# Altium schematic sheet Main.SchDoc: Raspberry Pi - Top Level Schematic
size 406 x 203 mm; DrawnBy: Kace Chandler; DocumentNumber: 1; SheetNumber: 1; SheetTotal: 23
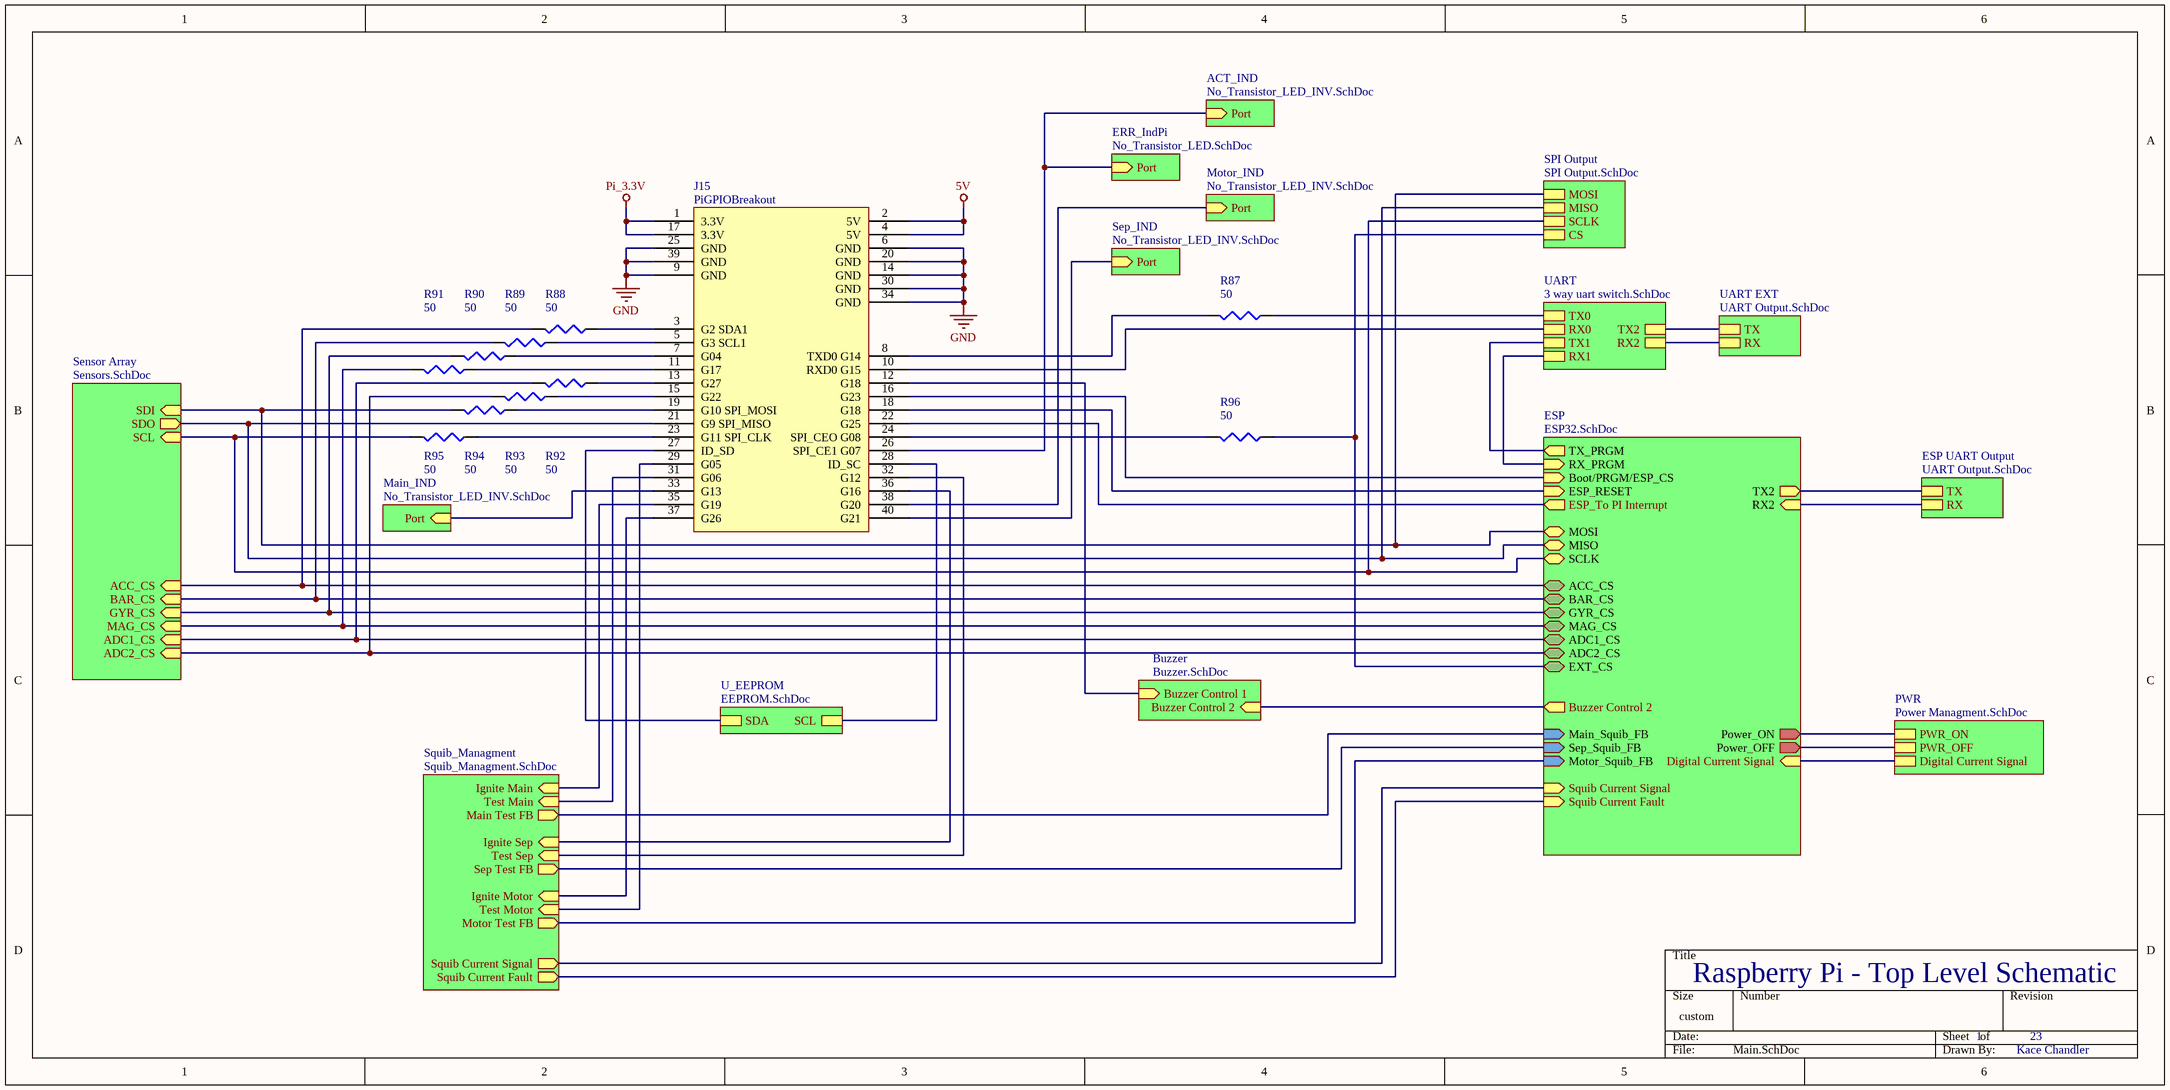
[diagram p0: Main.SchDoc]

## Parts
J15  PiGPIOBreakout  [RPI Through board connector]
R87  value 50  (hidden comment: Res3)
R88  value 50  (hidden comment: Res3)
R89  value 50  (hidden comment: Res3)
R90  value 50  (hidden comment: Res3)
R91  value 50  (hidden comment: Res3)
R92  value 50  (hidden comment: Res3)
R93  value 50  (hidden comment: Res3)
R94  value 50  (hidden comment: Res3)
R95  value 50  (hidden comment: Res3)
R96  value 50  (hidden comment: Res3)

## Sub-sheets
ACT_IND = No_Transistor_LED_INV.SchDoc: Port (in)
Buzzer = Buzzer.SchDoc: Buzzer Control 1 (in), Buzzer Control 2 (in)
ERR_IndPi = No_Transistor_LED.SchDoc: Port (in)
ESP = ESP32.SchDoc: TX_PRGM (out), RX_PRGM (in), Boot/PRGM/ESP_CS (in), RX2 (in), TX2 (out), SCLK (bidir), MISO (bidir), MOSI (bidir), Sep_Squib_FB (in), Main_Squib_FB (in), Motor_Squib_FB (in), Power_ON (out), Power_OFF (out), ACC_CS (bidir), BAR_CS (bidir), GYR_CS (bidir), MAG_CS (bidir), ADC1_CS (bidir), ADC2_CS (bidir), EXT_CS (bidir), ESP_RESET (in), Digital Current Signal (in), Squib Current Signal (in), Squib Current Fault (in), Buzzer Control 2 (out), ESP_To PI Interrupt (out)
ESP UART Output = UART Output.SchDoc: TX, RX
Main_IND = No_Transistor_LED_INV.SchDoc: Port (in)
Motor_IND = No_Transistor_LED_INV.SchDoc: Port (in)
PWR = Power Managment.SchDoc: PWR_ON, PWR_OFF, Digital Current Signal
Sensor Array = Sensors.SchDoc: ACC_CS (in), BAR_CS (in), GYR_CS (in), MAG_CS (in), ADC1_CS (in), ADC2_CS (in), SCL (in), SDO (out), SDI (in)
Sep_IND = No_Transistor_LED_INV.SchDoc: Port (in)
SPI Output = SPI Output.SchDoc: MOSI, MISO, SCLK, CS
Squib_Managment = Squib_Managment.SchDoc: Ignite Main (in), Test Main (in), Main Test FB (out), Ignite Sep (in), Test Sep (in), Sep Test FB (out), Ignite Motor (in), Test Motor (in), Motor Test FB (out), Squib Current Signal (out), Squib Current Fault (out)
U_EEPROM = EEPROM.SchDoc: SDA, SCL
UART = 3 way uart switch.SchDoc: TX1, RX1, TX2, RX2, TX0, RX0
UART EXT = UART Output.SchDoc: TX, RX

## Nets
5V: J15.2(5V) J15.4(5V)
GND: J15.6(GND) J15.9(GND) J15.14(GND) J15.20(GND) J15.25(GND) J15.30(GND) J15.34(GND) J15.39(GND)
Pi_3.3V: J15.1(3.3V) J15.17(3.3V)
NetJ15_3: J15.3(G2_SDA1) R88.1
NetJ15_5: J15.5(G3_SCL1) R89.1
NetJ15_7: J15.7(G04) R90.1
NetJ15_8: J15.8(TXD0_G14) R87.2
NetJ15_10: J15.10(RXD0_G15) ; sheet UART/RX0
NetJ15_11: J15.11(G17) R91.1
NetJ15_12: J15.12(G18) ; sheet Buzzer/Buzzer Control 1
NetJ15_13: J15.13(G27) R92.1
NetJ15_15: J15.15(G22) R93.1
NetJ15_16: J15.16(G23) ; sheet ESP/Boot/PRGM/ESP_CS
NetJ15_18: J15.18(G18) ; sheet ESP/ESP_RESET
NetJ15_19: J15.19(G10_SPI_MOSI) R94.1
NetJ15_21: J15.21(G9_SPI_MISO) ; sheet Sensor Array/SDO, sheet ESP/MISO, sheet SPI Output/MISO
NetJ15_22: J15.22(G25) ; sheet ESP/ESP_To PI Interrupt
NetJ15_23: J15.23(G11_SPI_CLK) R95.1
NetJ15_24: J15.24(SPI_CEO_G08) R96.2
NetJ15_26: J15.26(SPI_CE1_G07) ; sheet ERR_IndPi/Port, sheet ACT_IND/Port
NetJ15_27: J15.27(ID_SD) ; sheet U_EEPROM/SDA
NetJ15_28: J15.28(ID_SC) ; sheet U_EEPROM/SCL
NetJ15_29: J15.29(G05) ; sheet Squib_Managment/Test Motor
NetJ15_31: J15.31(G06) ; sheet Squib_Managment/Test Main
NetJ15_32: J15.32(G12) ; sheet Squib_Managment/Test Sep
NetJ15_33: J15.33(G13) ; sheet Main_IND/Port
NetJ15_35: J15.35(G19) ; sheet Squib_Managment/Ignite Main
NetJ15_36: J15.36(G16) ; sheet Squib_Managment/Ignite Sep
NetJ15_37: J15.37(G26) ; sheet Squib_Managment/Ignite Motor
NetJ15_38: J15.38(G20) ; sheet Motor_IND/Port
NetJ15_40: J15.40(G21) ; sheet Sep_IND/Port
NetR87_1: R87.1 ; sheet UART/TX0
NetR88_2: R88.2 ; sheet Sensor Array/ACC_CS, sheet ESP/ACC_CS
NetR89_2: R89.2 ; sheet Sensor Array/BAR_CS, sheet ESP/BAR_CS
NetR90_2: R90.2 ; sheet Sensor Array/GYR_CS, sheet ESP/GYR_CS
NetR91_2: R91.2 ; sheet Sensor Array/MAG_CS, sheet ESP/MAG_CS
NetR92_2: R92.2 ; sheet Sensor Array/ADC1_CS, sheet ESP/ADC1_CS
NetR93_2: R93.2 ; sheet Sensor Array/ADC2_CS, sheet ESP/ADC2_CS
NetR94_2: R94.2 ; sheet Sensor Array/SDI, sheet ESP/MOSI, sheet SPI Output/MOSI
NetR95_2: R95.2 ; sheet Sensor Array/SCL, sheet ESP/SCLK, sheet SPI Output/SCLK
NetR96_1: R96.1 ; sheet ESP/EXT_CS, sheet SPI Output/CS
(unnamed): sheet Buzzer/Buzzer Control 2, sheet ESP/Buzzer Control 2
(unnamed): sheet PWR/PWR_ON, sheet ESP/Power_ON
(unnamed): sheet PWR/PWR_OFF, sheet ESP/Power_OFF
(unnamed): sheet PWR/Digital Current Signal, sheet ESP/Digital Current Signal
(unnamed): sheet ESP/TX_PRGM, sheet UART/TX1
(unnamed): sheet ESP/RX_PRGM, sheet UART/RX1
(unnamed): sheet ESP/RX2, sheet ESP UART Output/RX
(unnamed): sheet ESP/TX2, sheet ESP UART Output/TX
(unnamed): sheet ESP/Sep_Squib_FB, sheet Squib_Managment/Sep Test FB
(unnamed): sheet ESP/Main_Squib_FB, sheet Squib_Managment/Main Test FB
(unnamed): sheet ESP/Motor_Squib_FB, sheet Squib_Managment/Motor Test FB
(unnamed): sheet ESP/Squib Current Signal, sheet Squib_Managment/Squib Current Signal
(unnamed): sheet ESP/Squib Current Fault, sheet Squib_Managment/Squib Current Fault
(unnamed): sheet UART/TX2, sheet UART EXT/TX
(unnamed): sheet UART/RX2, sheet UART EXT/RX

## Library data of the parts
R87-R96 = Res3: Resistor; Published: 8-Jun-2000; LatestRevisionDate: 29-May-2009; LatestRevisionNote: IPC-7351 Footprint Added.; PackageReference: J1-0603; Publisher: Altium Limited; PackageDescription: Chip Resistor
J15 = PiGPIOBreakout: Supplier 1: Digi-Key; Supplier Part Number 1: 952-3218-ND